# EAGLE design PIC12F_boost_2021_09_29_A (EAGLE 9.6.1)
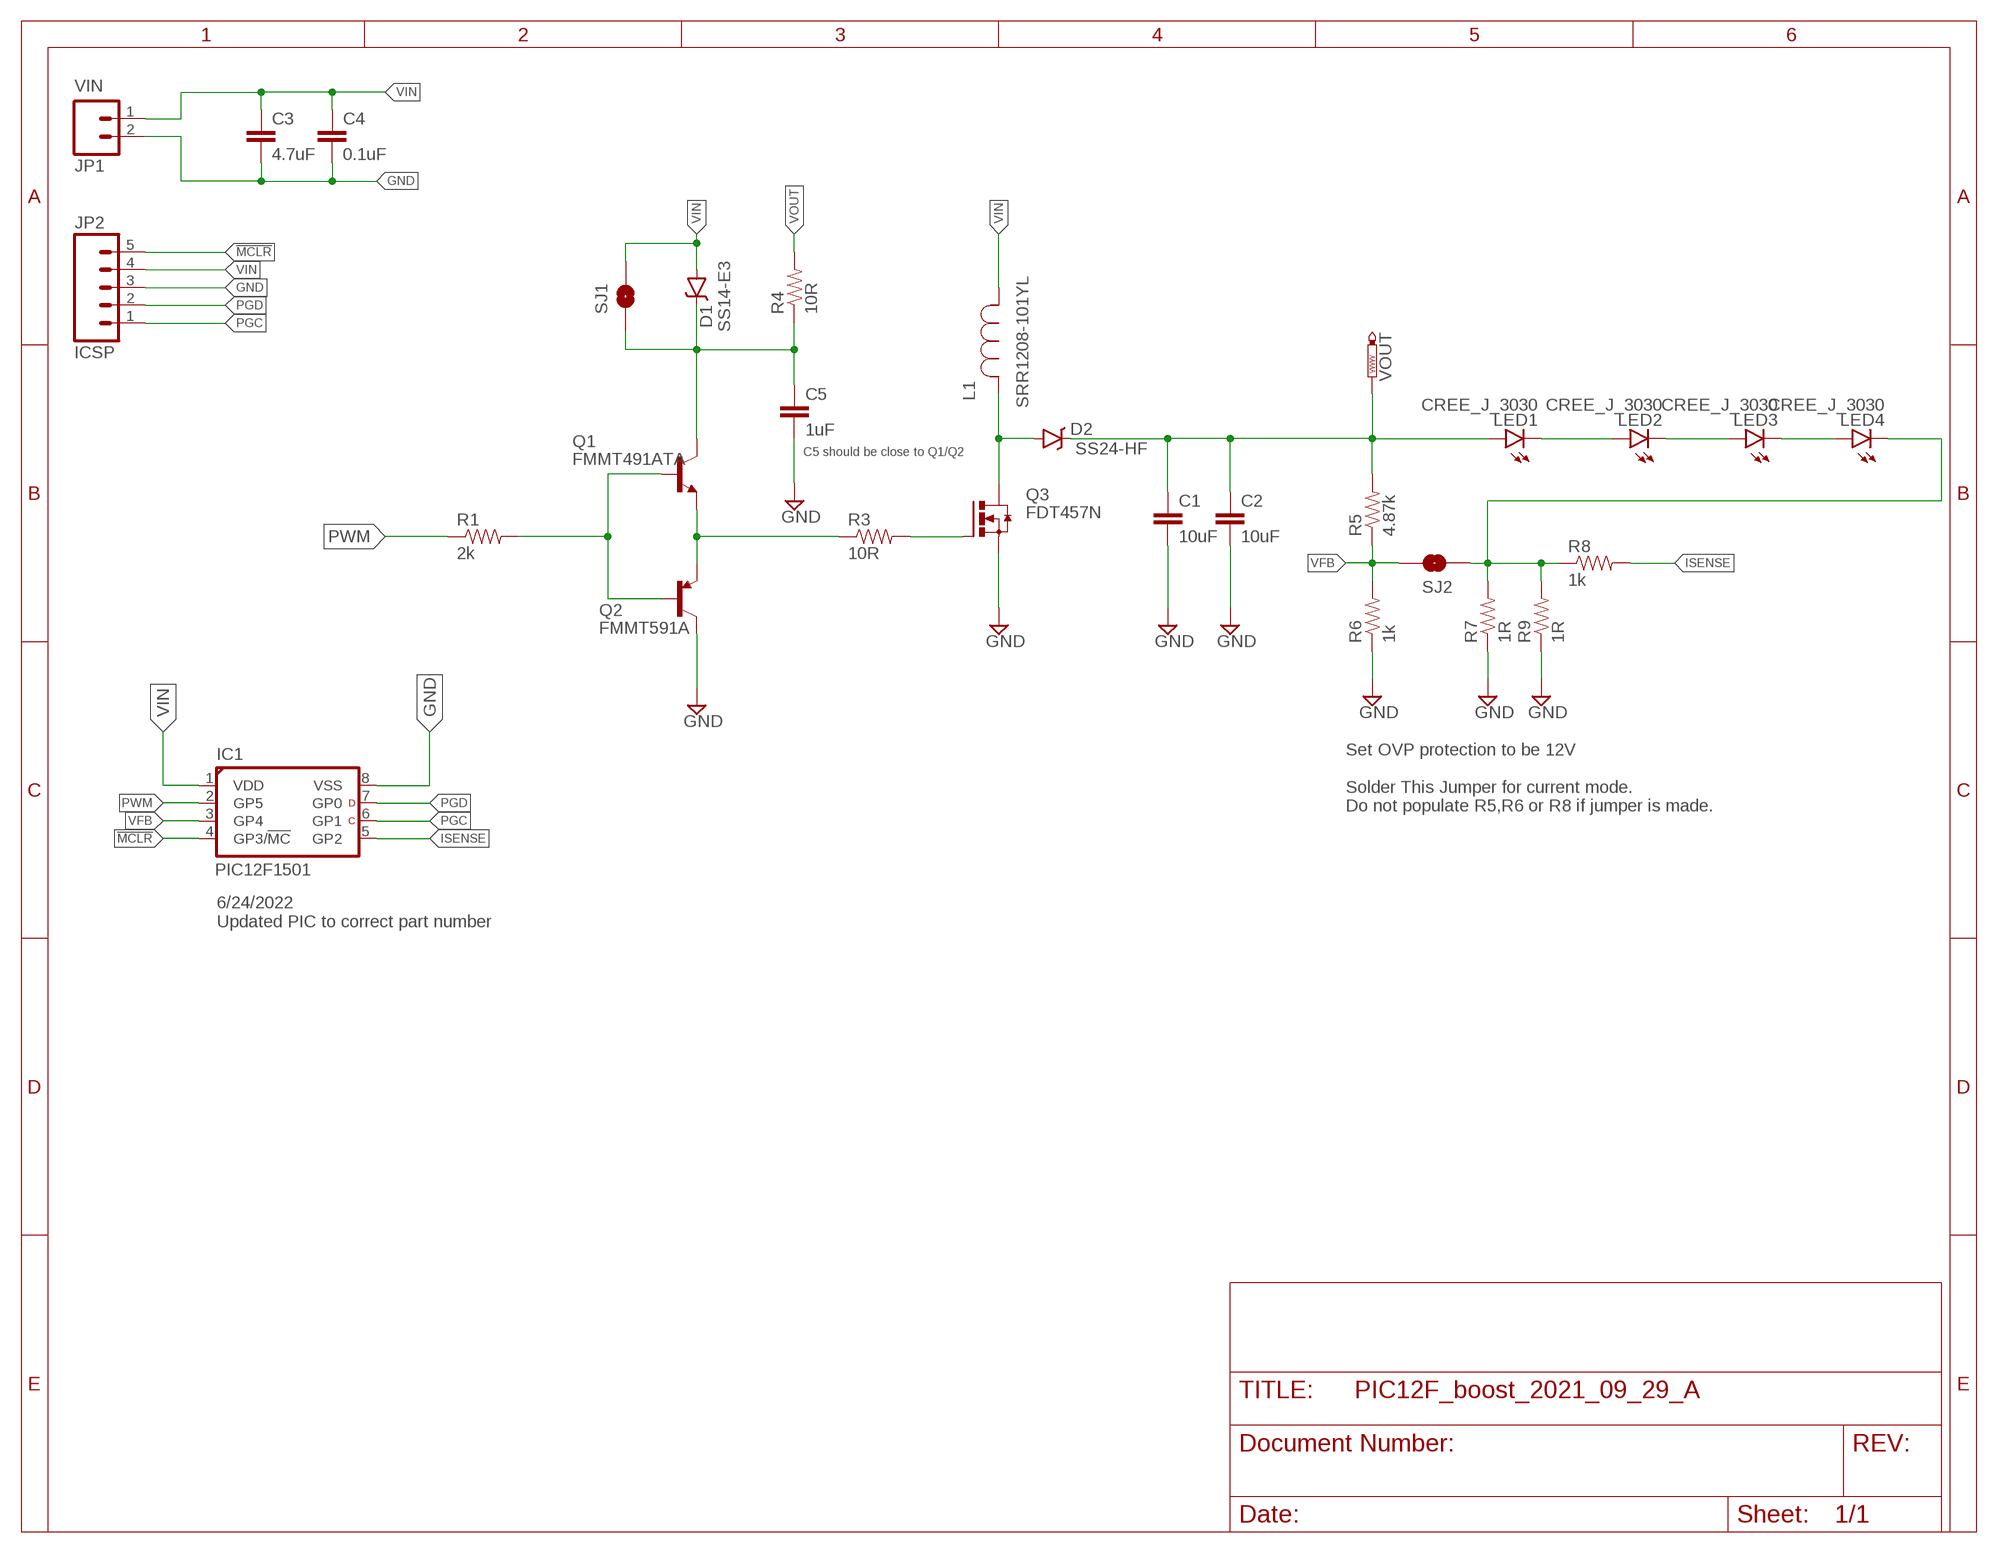
[diagram p0: schematic, sheet 1]

## Parts
C1  10uF  CAP1206  [1206]
C2  10uF  CAP1206  [1206]
C3  4.7uF  CAP1206  [1206]
C4  0.1uF  CAP1206  [1206]
C5  1uF  CAP1206  [1206]
D1  SS14-E3  DIODE-SCHOTTKY-BAT20J  [SOD-323]
D2  SS24-HF  DIODE-SCHOTTKY-MBRA140  [SMA-DIODE]
IC1  PIC12F1501  PIC12F510/SN  [SOIC8-SN]
JP1  M02POLAR_LOCK  [MOLEX-1X2_LOCK]
JP2  ICSP  M05LOCK_LONGPADS  [1X05_LOCK_LONGPADS]
L1  SRR1208-101YL  [IND_BOURNS_SRR1208]
LED1  CREE_J_3030  [CREE_J_3030]
LED2  CREE_J_3030  [CREE_J_3030]
LED3  CREE_J_3030  [CREE_J_3030]
LED4  CREE_J_3030  [CREE_J_3030]
Q1  FMMT491ATA  TRANSISTOR_NPNMMBT5088  [SOT23]
Q2  FMMT591A  TRANSISTOR_PNPMMBT4403  [SOT23]
Q3  FDT457N  N-HEXFET_SOT323-  [SOT223]
R1  2k  RESISTOR1206  [1206]
R3  10R  RESISTOR1206  [1206]
R4  10R  RESISTOR1206  [1206]
R5  4.87k  RESISTOR1206  [1206]
R6  1k  RESISTOR1206  [1206]
R7  1R  RESISTOR1206  [1206]
R8  1k  RESISTOR1206  [1206]
R9  1R  RESISTOR1206  [1206]
SJ1  SPARKFUN_SOLDERJUMPERNO  [SPARKFUN_SJ_2S-NO]
SJ2  SPARKFUN_SOLDERJUMPERNO  [SPARKFUN_SJ_2S-NO]
VOUT  PTR1TP20R  [TP20R]

## Nets
!MCLR: IC1.4(GP3/!MC!) JP2.5
DRIVE: Q1.2(E) Q2.2(E) R3.1
GATE: Q3.1(G) R3.2
GND: C1.2 C2.2 C3.2 C4.2 C5.2 IC1.8(VSS) JP1.2 JP2.3 Q2.3(C) Q3.3(S) R6.1 R7.1 R9.1
ISENSE: IC1.5(GP2) R8.2
N$2: Q1.1(B) Q2.1(B) R1.2
N$3: C5.1 D1.C Q1.3(C) R4.1 SJ1.1
N$6: LED1.C LED2.A LED2.A2(A)
N$7: LED2.C LED3.A LED3.A2(A)
N$8: LED3.C LED4.A LED4.A2(A)
PGC: IC1.6(GP1) JP2.1
PGD: IC1.7(GP0) JP2.2
PWM: IC1.2(GP5) R1.1
SW: D2.A L1.2 Q3.4(D)
VFB: IC1.3(GP4) R5.1 R6.2 SJ2.2
VIN: C3.1 C4.1 D1.A IC1.1(VDD) JP1.1 JP2.4 L1.1 SJ1.2
VOUT: C1.1 C2.1 D2.C LED1.A LED1.A2(A) R4.2 R5.2 VOUT.TP
VOUT-: LED4.C R7.2 R8.1 R9.2 SJ2.1

## Notes on the sheet
- VIN
- C5 should be close to Q1/Q2
- Set OVP protection to be 12V
  
  Solder This Jumper for current mode. 
  Do not populate R5,R6 or R8 if jumper is made.
- 6/24/2022
  Updated PIC to correct part number

## Library data of the parts
C1-C5 = SparkFun-Capacitors:CAP: Capacitor Standard 0603 ceramic capacitor, and 0.1" leaded capacitor.
D1 = SparkFun-DiscreteSemi:DIODE-SCHOTTKY: Schottky diodes in SFE's production catalog BAT20J 1A 23V 0.62Vf RB751 120mA 40V 0.37Vf PMEG4005EJ 0.5A 40V 0.42Vf MBRA140 1A 40V 0.5Vf B340A 3A 40V SMA; PROD_ID: DIO-11623; VALUE: BAT20J
D2 = SparkFun-DiscreteSemi:DIODE-SCHOTTKY: Schottky diodes in SFE's production catalog BAT20J 1A 23V 0.62Vf RB751 120mA 40V 0.37Vf PMEG4005EJ 0.5A 40V 0.42Vf MBRA140 1A 40V 0.5Vf B340A 3A 40V SMA; PROD_ID: DIO-08053; VALUE: MBRA140
IC1 = microchip_pic12f:PIC12F510: Low pincount microcontroller http://www.microchip.com/wwwproducts/Devices.aspx?product=PIC12F510 Properties Parameter Name Value Program Memory Type Flash Program Memory (KB) 1.5 CPU Speed (MIPS) 2 RAM Bytes 38 Timers 1 x 8-bit ADC 3 ch, 8-bit Comparators 1 Temperature Range (C) -40 to 125 Operating Voltage Range (V) 2 to 5.5 Pin Count 8 Cap Touch Channels 3 Features 8-pin packaging Precision 4/8 MHz internal oscillator 3 channels 8-bit ADC (Analog to Digital Converter) On-board Comparator 1.125ms DRT (Device Reset Timer) Baseline Core with 33 Instructions, 2 Stack Levels All single-cycle Instructions except for program branches which are two cycles 12-bit wide instructions 8-bit wide data path 25 mA source/sink current I/O Low power (100nA) sleep current One 8-bit timer (TMR0) Watchdog timer (WDT) In Circuit Serial Programming™ (ICSP™) capability In-Circuit debugging support Programmable code protection Library from www.mikroelektroniikka.fi/lbr
JP1 = SparkFun-Connectors:M02: Standard 2-pin 0.1" header. Use with - straight break away headers ( PRT-00116) - right angle break away headers (PRT-00553) - swiss pins (PRT-00743) - machine pins (PRT-00117) - female headers (PRT-00115) Molex polarized connector foot print use with: PRT-08233 with associated crimp pins and housings. 2.54_SCREWTERM for use with PRT-10571. 3.5mm Screw Terminal footprints for PRT-08084 5mm Screw Terminal footprints for use with PRT-08432
JP2 = SparkFun-Connectors:M05: Header 5 Standard 5-pin 0.1" header. Use with straight break away headers (SKU : PRT-00116), right angle break away headers (PRT-00553), swiss pins (PRT-00743), machine pins (PRT-00117), and female headers (PRT-00115). Molex polarized connector foot print use with SKU : PRT-08230 with associated crimp pins and housings.
L1 = SRR1208:SRR1208-101YL; COPYRIGHT: Copyright (C) 2021 Ultra Librarian. All rights reserved.; DIGI-KEY_PART_NUMBER_1: SRR1208-101YLCT-ND; DIGI-KEY_PART_NUMBER_2: SRR1208-101YLDKR-ND; DIGI-KEY_PART_NUMBER_3: SRR1208-101YLTR-ND; MANUFACTURER_PART_NUMBER: SRR1208-101YL; MFR_NAME: Bourns Electronics
LED1-LED4 = Cree J Series 3030:CREE_J_3030
Q1 = SparkFun-DiscreteSemi:TRANSISTOR_NPN: Generic NPN BJT MMBT2222A - TRANS-08049 (SOT-23, 1A 40V) MPSA42 - TRANS-09116 (SOT-23, 500mA 300V) MMBT5088LT1G - TRANS-11160 (SOT-23, 50 mA 30V) BC547 - COM-08928 <http://www.sparkfun.com/products/8928> (TO-92 45V 100mA) (1.Collector 2.Base 3.Emitter) 2N3904 - COM-00521 <http://www.sparkfun.com/products/521> (TO-92 40V 200mA) (1.Emitter 2.Base 3.Collector) P2N2222A - COM-12852 <http://www.sparkfun.com/products/12852> (TO-92 40V 600mA) (1.Collector 2.Base 3.Emitter); PROD_ID: TRANS-11160; VALUE: MMBT5088
Q2 = SparkFun-DiscreteSemi:TRANSISTOR_PNP: Generic PNP BJT Double check pinouts against datasheets- not all devices are the same! MMBT3906 - 40V 200mA SOT-23 (TRANS-08052) MMBT4403 - 40V 600mA SOT-23 (TRANS-09245); PROD_ID: TRANS-09245; VALUE: MMBT4403
Q3 = transistor-power:N-HEXFET_?-*: HEXFET® Power MOSFET
R1 R3-R9 = SparkFun-Resistors:RESISTOR: Resistor Basic schematic elements and footprints for 0603, 1206, and PTH resistors.
SJ1 SJ2 = DECADE-libraries20151104:SPARKFUN_SOLDERJUMPER: Solder Jumper Standard SMD solder jumper. Used to automate production. Two varients : Normally Open and Normally Closed are the same, but have different paste layers. NC will have a large amount of paste and should jumper during reflow.
VOUT = testpad:PTR1: TEST PIN

## Board
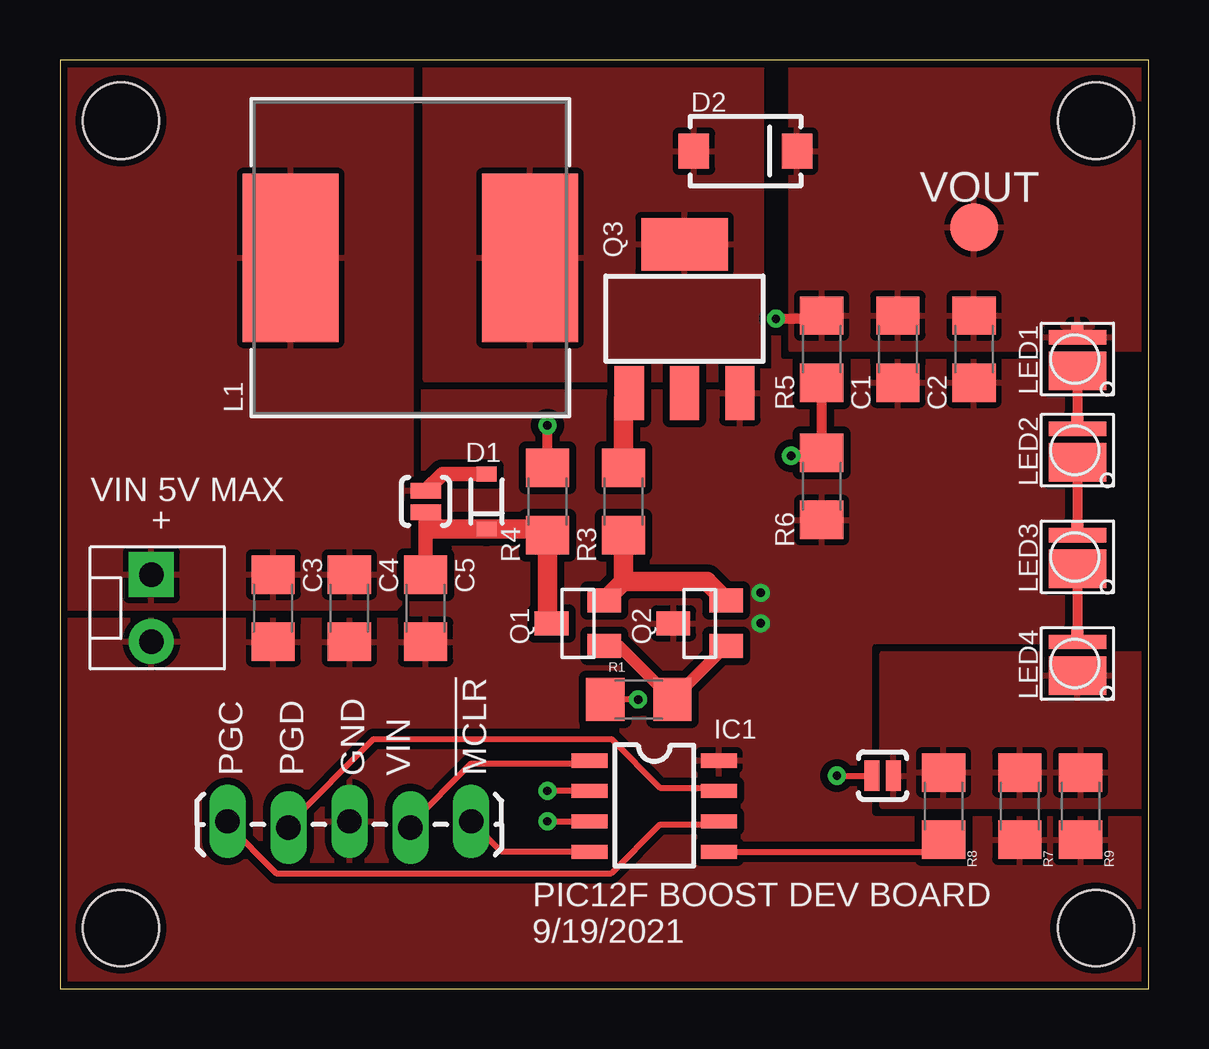
[diagram p1: board, top side]
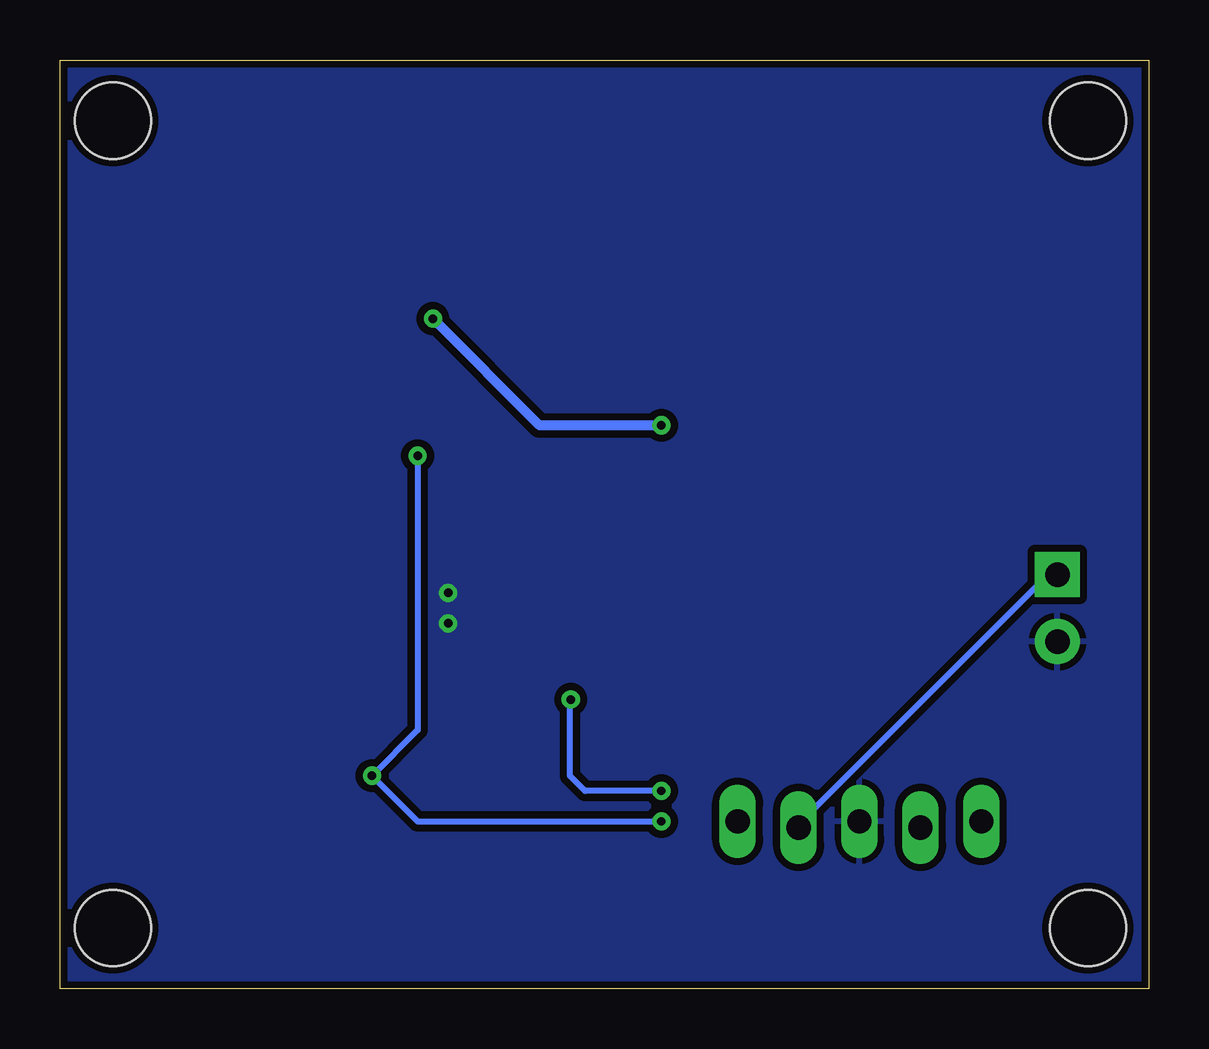
[diagram p2: board, bottom side, seen from below]

Size 45.39 x 38.73 mm. Coordinates in mm from the lower left corner, seen from the top.
Outline: 0,0 45.39,0 45.39,38.73 0,38.73 0,0
Copper layers (1*16): Top 0.035mm / dielectric 1.5mm / Bottom 0.035mm
Design rules "default": minimum track width 10mil, minimum drill 0.35mm, track to track 10mil, track to pad 10mil, pad to pad 10mil, via to via 10mil, smd to smd 6mil, copper to edge 10mil, drill to drill 6mil, minimum pad ring 10mil, minimum via ring 8mil, stop-mask expansion 4mil, vias tented up to drill 0mil, thermal gap 10mil
Holes 3.17 mm at 2.54,2.54 2.54,36.2 43.18,36.2 43.18,2.54

### Footprints (pad centres in the part's own frame; a part is rotated, then mirrored left to right if it is on the bottom)
1206 = smd 1.6 x 1.8: 1 -1.4,0; 2 1.4,0
SOD-323 = smd 0.63 x 0.83: A 1.15,0; C -1.15,0
SMA-DIODE = smd 1.27 x 1.47: A -2.15,0; C 2.15,0
SOIC8-SN = smd 0.6 x 1.5: 1 -1.905,-2.7; 2 -0.635,-2.7; 3 0.635,-2.7; 4 1.905,-2.7; 5 1.905,2.7; 6 0.635,2.7; 7 -0.635,2.7; 8 -1.905,2.7
MOLEX-1X2_LOCK = drill 1.016 pad 1.88 square: 1 -0.127,0 | drill 1.016 pad 1.88: 2 2.667,0
1X05_LOCK_LONGPADS = drill 1.016 long: 1 0,0; 2 2.54,-0.254; 3 5.08,0; 4 7.62,-0.254; 5 10.16,0
IND_BOURNS_SRR1208 = smd 3.988 x 7.01: 1 -4.991,0; 2 4.991,0
CREE_J_3030 = smd 0.6 x 2.4: A 2.4,-0.5 | smd 0.3 x 0.5: A2 2.85,-0.5 | smd 1.6 x 2.4: C 1,-0.5
SOT23 = smd 1 x 1.4: 1 -0.95,-1.1; 2 0.95,-1.1; 3 0,1.1
SOT223 = smd 1.219 x 2.235: 1 -2.311,-3.099; 2 0,-3.099; 3 2.311,-3.099 | smd 3.6 x 2.2: 4 0,3.099
SPARKFUN_SJ_2S-NO = smd 0.635 x 1.27: 1 -0.45,0; 2 0.45,0
TP20R = smd 2 x 2: TP 0,0

### Placement (x,y rotation side)
C1  34.93,26.67 270 top
C2  38.1,26.67 270 top
C3  8.89,15.88 270 top
C4  12.07,15.88 270 top
C5  15.24,15.88 270 top
D1  17.78,20.32 90 top
D2  28.58,34.92 0 top
IC1  24.77,7.62 270 top
JP1  3.81,17.14 270 top
JP2  6.98,6.98 0 top
L1  14.61,30.48 0 top
LED1  41.91,24.77 90 top
LED2  41.91,20.95 90 top
LED3  41.91,16.51 90 top
LED4  41.91,12.06 90 top
Q1  21.59,15.24 90 top
Q2  26.67,15.24 90 top
Q3  26.04,27.94 0 top
R1  24.13,12.06 0 top
R3  23.49,20.32 90 top
R4  20.32,20.32 90 top
R5  31.75,26.67 90 top
R6  31.75,20.95 90 top
R7  40.01,7.62 90 top
R8  36.83,7.62 270 top
R9  42.55,7.62 90 top
SJ1  15.24,20.32 90 top
SJ2  34.29,8.89 180 top
VOUT  38.1,31.75 0 top

### Tracks (layer width: path | path; a pad name or v marks a point on that pad's centre or on a via)
!MCLR
  Top 0.254: IC1.4 18.41,5.71 JP2.5
DRIVE
  Top 0.813: Q1.2 23.49,17 | 23.49,17 R3.1 | Q2.2 26.97,17 23.49,17
GATE
  Top 0.813: R3.2 23.49,24.61 Q3.1
GND  (via drill 0.35)
  other vias: 29.21,15.24 29.21,16.51
  pour Top (isolate 0.305, rank 6): 0,39.37 47.63,39.37 47.63,-0.63 -0.63,-0.63 -0.63,38.73
  pour Bottom (isolate 0.305): -1.27,40.64 46.35,40.64 47.63,39.37 47.63,-2.54 46.99,-3.18 0,-3.18 -1.9,-1.27 -1.9,40.01
ISENSE
  Top 0.254: IC1.5 36.33,5.71 R8.2
N$2
  Top 0.508: Q2.1 27.76,14.29 R1.2 23.3,14.29 Q1.1
N$3
  Top 0.61: SJ1.1 15.24,19.05 | 15.24,19.05 C5.1 | 15.36,19.17 15.24,19.05
  Top 0.813: Q1.3 20.32,15.41 R4.1 20.07,19.17 D1.C 15.36,19.17
N$6
  Top 0.254: LED2.A2 42.55,23.88 42.41,23.88
  Top 0.406: LED1.C 42.41,23.88 LED2.A2 LED2.A
N$7
  Top 0.254: LED3.A2 42.55,19.3 42.41,19.3
  Top 0.406: LED2.C LED3.A2 42.41,19.3 LED3.A
N$8
  Top 0.254: LED4.A2 42.55,14.99 42.41,14.99
  Top 0.406: LED3.C 42.41,14.99 LED4.A2 LED4.A
PGC
  Top 0.254: IC1.6 27.3,6.86 25.02,6.86 22.99,4.83 9.02,4.83 6.98,6.86 JP2.1
PGD
  Top 0.254: IC1.7 27.3,8.38 25.02,8.38 22.99,10.41 13.08,10.41 9.53,6.86 JP2.2
PWM  (via drill 0.35)
  Top 0.254: IC1.2 v20.32,8.25 | v24.1,12.06 R1.1
  Bottom 0.254: v20.32,8.25 23.49,8.25 24.13,8.89 24.13,12.06 v24.1,12.06
SW
  pour Top (isolate 0.305): 15.24,39.37 29.21,39.37 29.21,25.4 15.24,25.4
VFB  (via drill 0.35)
  Top 0.254: v32.38,8.89 SJ2.2 | v20.32,6.98 IC1.3
  Top 0.406: R6.2 R5.1
  Top 0.508: R6.2 31.62,22.22 v30.48,22.22
  Bottom 0.254: v30.48,22.22 30.48,10.79 v32.38,8.89 30.48,6.98 v20.32,6.98
VIN
  Top 0.254: IC1.1 21.97,9.4 17.15,9.4 14.61,6.86 JP2.4
  Top 0.61: D1.A 15.94,21.47 SJ1.2
  Bottom 0.254: JP1.1 4.19,17.27 14.61,6.86 JP2.4
  pour Top (isolate 0.305): 0,40.01 14.61,40.01 14.61,16.51 13.97,15.88 0,15.88 -0.63,16.51 -0.63,39.37
VOUT  (via drill 0.35)
  Top 0.406: R4.2 v20.32,23.49 | v29.84,27.94 31.62,27.94 R5.2
  Bottom 0.406: v20.32,23.49 25.4,23.49 v29.84,27.94
  pour Top (isolate 0.305): 30.48,39.37 46.35,39.37 46.35,26.67 30.48,26.67
VOUT-
  pour Top (isolate 0.305): 34.29,13.97 45.72,13.97 45.72,7.62 34.29,7.62

### Text on the board
tNames: VIN 5V MAX | + | PGC | PGD | GND | VIN | !MCLR | PIC12F BOOST DEV BOARD / 9/19/2021